# EAGLE schematic ex4_1 (EAGLE 9.5.2)
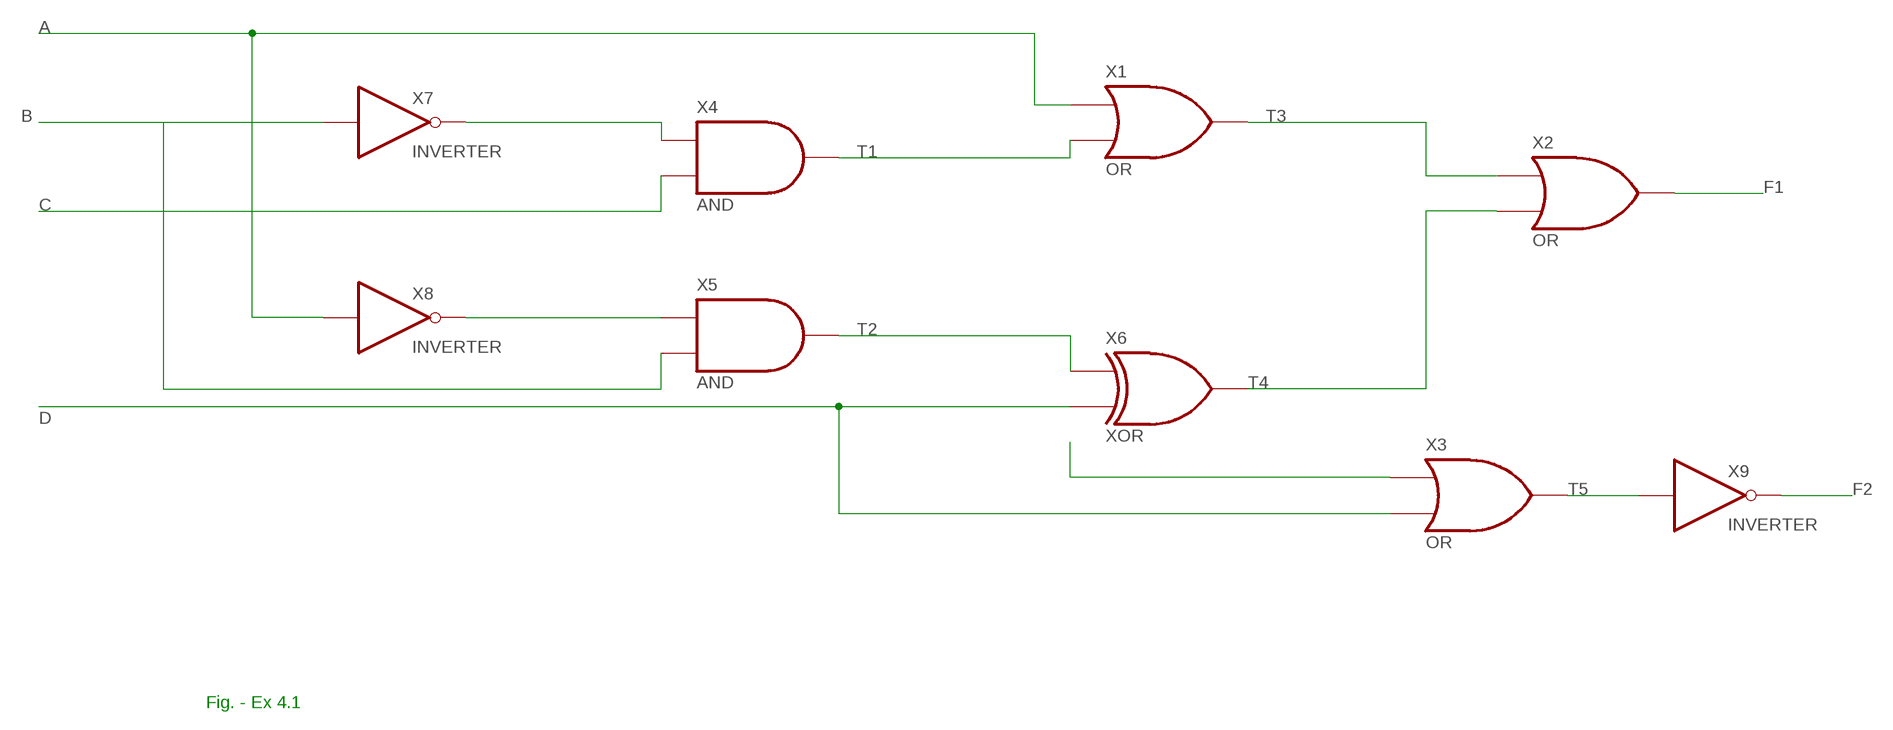
[diagram p0: schematic, sheet 1]

## Parts
X1  OR  (no package)
X2  OR  (no package)
X3  OR  (no package)
X4  AND  (no package)
X5  AND  (no package)
X6  XOR  (no package)
X7  INVERTER  (no package)
X8  INVERTER  (no package)
X9  INVERTER  (no package)

## Nets
A: X1.A X8.I
B: X5.B X7.I
C: X4.B
D: X3.B X6.B
F1: X2.Y
F2: X9.O
N$5: X4.A X7.O
N$7: X3.A
N$9: X5.A X8.O
T1: X1.B X4.Y
T2: X5.Y X6.A
T3: X1.Y X2.A
T4: X2.B X6.Y
T5: X3.Y X9.I

## Notes on the sheet
- Fig. - Ex 4.1

## Library data of the parts
X1-X3 = ngspice-digital:OR: 2 input logic OR gate
X4 X5 = ngspice-digital:AND: 2 input logic AND gate
X6 = ngspice-digital:XOR: 2 input XOR gate
X7-X9 = ngspice-digital:INVERTER: logic inverter (NOT gate)